# EAGLE design ESP32 Breakout (EAGLE 9.6.2)
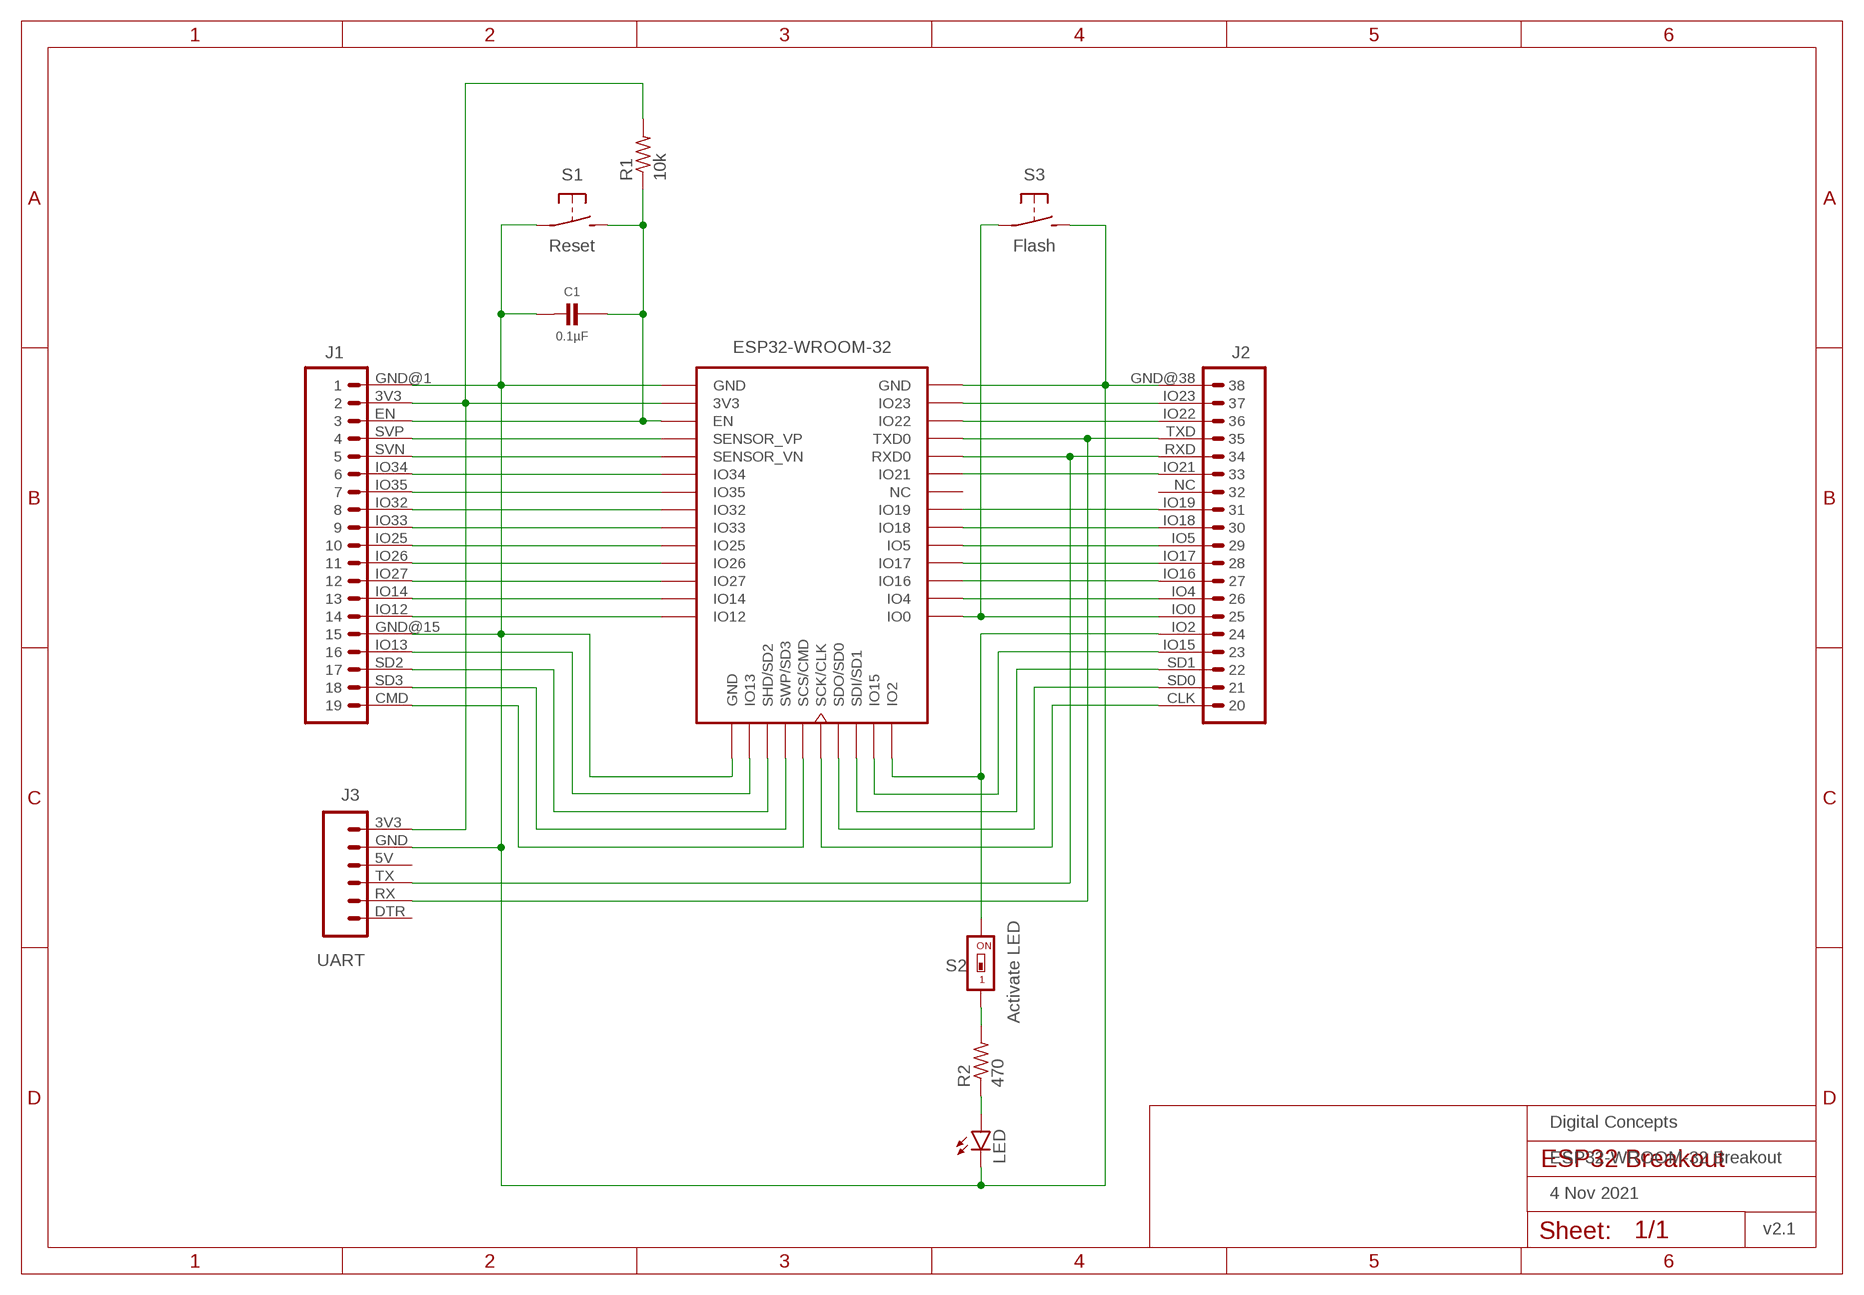
[diagram p0: schematic, sheet 1]
FRAME1 (A4L-LOC): DATE: 4 Nov 2021; OWNER: Digital Concepts; TITLE: ESP32-WROOM-32 Breakout; VERSION: v2.1

## Parts
C1  0.1µF  CAPACITOR-0805  [C0805]
J1  HEADER-1X19-ESP32-L  [CONN_19-ESP32-L]
J2  HEADER-1X19-ESP32-R  [CONN_19-ESP32-R]
J3  UART  HEADER-1X6-UART  [CONN_06-UART]
LED  LEDCHIP-LED0805  [CHIP-LED0805]
R1  10k  RESISTOR-VIA-2  [R0805-VIA-2]
R2  470  RESISTORR0805  [R0805]
S1  Reset  SWITCH-MOMENTARY-2-PIN  [SWITCH-2-PAD]
S2  Activate LED  SWITCH-DIP-SWS001  [SMD-001]
S3  Flash  SWITCH-MOMENTARY-2-PIN  [SWITCH-2-PAD]
U1  ESP32-WROOM-32  ESP32-WROOM-32-CHIP  [ESP32-WROOM-32]

## Nets
GND: C1.2 J1.GND@1 J1.GND@15 J2.GND@38 J3.GND LED.C S1.P$1(P) S3.P$2(S) U1.GND@1(GND) U1.GND@15(GND) U1.GND@38(GND) U1.TP(GND) U1.TP@P1(GND) U1.TP@P2(GND) U1.TP@P3(GND) U1.TP@P4(GND) U1.TP@P5(GND) U1.TP@P6(GND) U1.TP@P7(GND) U1.TP@P8(GND) U1.TP@P9(GND) U1.TP@V1(GND) U1.TP@V2(GND) U1.TP@V3(GND) U1.TP@V4(GND) U1.TP@V5(GND) U1.TP@V6(GND) U1.TP@V7(GND) U1.TP@V8(GND) U1.TP@V9(GND) U1.TP@V10(GND) U1.TP@V11(GND) U1.TP@V12(GND) U1.TP@VP5(GND)
N$1: R2.2 S2.1
N$2: J1.SVP U1.SENSOR_VP
N$3: C1.1 J1.EN R1.1 S1.P$2(S) U1.EN
N$4: J1.IO32 U1.IO32
N$5: J1.SVN U1.SENSOR_VN
N$6: J1.IO34 U1.IO34
N$7: J1.IO35 U1.IO35
N$8: LED.A R2.1
N$13: J2.IO19 U1.IO19
N$14: J2.IO17 U1.IO17
N$15: J1.CMD U1.CMD(SCS/CMD)
N$16: J2.IO18 U1.IO18
N$17: J2.IO22 U1.IO22
N$18: J2.IO15 U1.IO15
N$19: J2.CLK U1.CLK(SCK/CLK)
N$20: J2.SD0 U1.SD0(SDO/SD0)
N$21: J2.SD1 U1.SD1(SDI/SD1)
N$22: J2.IO23 U1.IO23
N$23: J2.IO2 S2.2 U1.IO2
N$24: J2.IO0 S3.P$1(P) U1.IO0
N$25: J2.IO4 U1.IO4
N$26: J2.IO16 U1.IO16
N$28: J2.IO5 U1.IO5
N$31: J2.RXD J3.TX U1.RXD0
N$32: J2.TXD J3.RX U1.TXD0
N$35: J2.IO21 U1.IO21
N$36: J1.IO33 U1.IO33
N$38: J1.IO25 U1.IO25
N$39: J1.IO26 U1.IO26
N$40: J1.IO27 U1.IO27
N$41: J1.IO14 U1.IO14
N$42: J1.IO12 U1.IO12
N$43: J1.SD2 U1.SD2(SHD/SD2)
N$45: J1.IO13 U1.IO13
N$46: J1.SD3 U1.SD3(SWP/SD3)
VCC: J1.3V3 J3.3V3 R1.2 R1.2@VIA U1.3V3
Unconnected: J2.NC J3.5V J3.DTR U1.NC

## Library data of the parts
C1 = digitalconcepts:CAPACITOR-0805: 0805 Capacitor
J1 = digitalconcepts:HEADER-1X19-ESP32-L: ESP32 Left 19-Pin Header
J2 = digitalconcepts:HEADER-1X19-ESP32-R: ESP32 Right 19-Pin Header
J3 = digitalconcepts:HEADER-1X6-UART: Single Row 6-Pin UART Header
LED = digitalconcepts:LED: LED OSRAM: - CHIPLED LG R971, LG N971, LY N971, LG Q971, LY Q971, LO R971, LY R971 LH N974, LH R974 LS Q976, LO Q976, LY Q976 LO Q996 - Hyper CHIPLED LW Q18S LB Q993, LB Q99A, LB R99A - SideLED LS A670, LO A670, LY A670, LG A670, LP A670 LB A673, LV A673, LT A673, LW A673 LH A674 LY A675 LS A676, LA A676, LO A676, LY A676, LW A676 LS A679, LY A679, LG A679 - Hyper Micro SIDELED® LS Y876, LA Y876, LO Y876, LY Y876 LT Y87S - SmartLED LW L88C, LW L88S LB L89C, LB L89S, LG L890 LS L89K, LO L89K, LY L89K LS L896, LA L896, LO L896, LY L896 - TOPLED LS T670, LO T670, LY T670, LG T670, LP T670 LSG T670, LSP T670, LSY T670, LOP T670, LYG T670 LG T671, LOG T671, LSG T671 LB T673, LV T673, LT T673, LW T673 LH T674 LS T676, LA T676, LO T676, LY T676, LB T676, LH T676, LSB T676, LW T676 LB T67C, LV T67C, LT T67C, LS T67K, LO T67K, LY T67K, LW E67C LS E67B, LA E67B, LO E67B, LY E67B, LB E67C, LV E67C, LT E67C LW T67C LS T679, LY T679, LG T679 LS T770, LO T770, LY T770, LG T770, LP T770 LB T773, LV T773, LT T773, LW T773 LH T774 LS E675, LA E675, LY E675, LS T675 LS T776, LA T776, LO T776, LY T776, LB T776 LHGB T686 LT T68C, LB T68C - Hyper Mini TOPLED® LB M676 - Mini TOPLED Santana® LG M470 LS M47K, LO M47K, LY M47K Source: http://www.osram.convergy.de LUXEON: - LUMILED® LXK2-PW12-R00, LXK2-PW12-S00, LXK2-PW14-U00, LXK2-PW14-V00 LXK2-PM12-R00, LXK2-PM12-S00, LXK2-PM14-U00 LXK2-PE12-Q00, LXK2-PE12-R00, LXK2-PE12-S00, LXK2-PE14-T00, LXK2-PE14-U00 LXK2-PB12-K00, LXK2-PB12-L00, LXK2-PB12-M00, LXK2-PB14-N00, LXK2-PB14-P00, LXK2-PB14-Q00 LXK2-PR12-L00, LXK2-PR12-M00, LXK2-PR14-Q00, LXK2-PR14-R00 LXK2-PD12-Q00, LXK2-PD12-R00, LXK2-PD12-S00 LXK2-PH12-R00, LXK2-PH12-S00 LXK2-PL12-P00, LXK2-PL12-Q00, LXK2-PL12-R00 Source: www.luxeon.com KINGBRIGHT: KA-3528ASYC Source: www.kingbright.com
R1 = digitalconcepts:RESISTOR-VIA-2: Resistor with via on Pad 2
R2 = digitalconcepts:RESISTOR: Resistor; SPICEPREFIX: R
S1 S3 = digitalconcepts:SWITCH-MOMENTARY-2-PIN: 2 Pin Momentary Switch
S2 = digitalconcepts:SWITCH-DIP-SWS001: SMD Dip Switch 1 pol.
U1 = digitalconcepts:ESP32-WROOM-32-CHIP: ESP32-WROOM-32 Chip

## Board
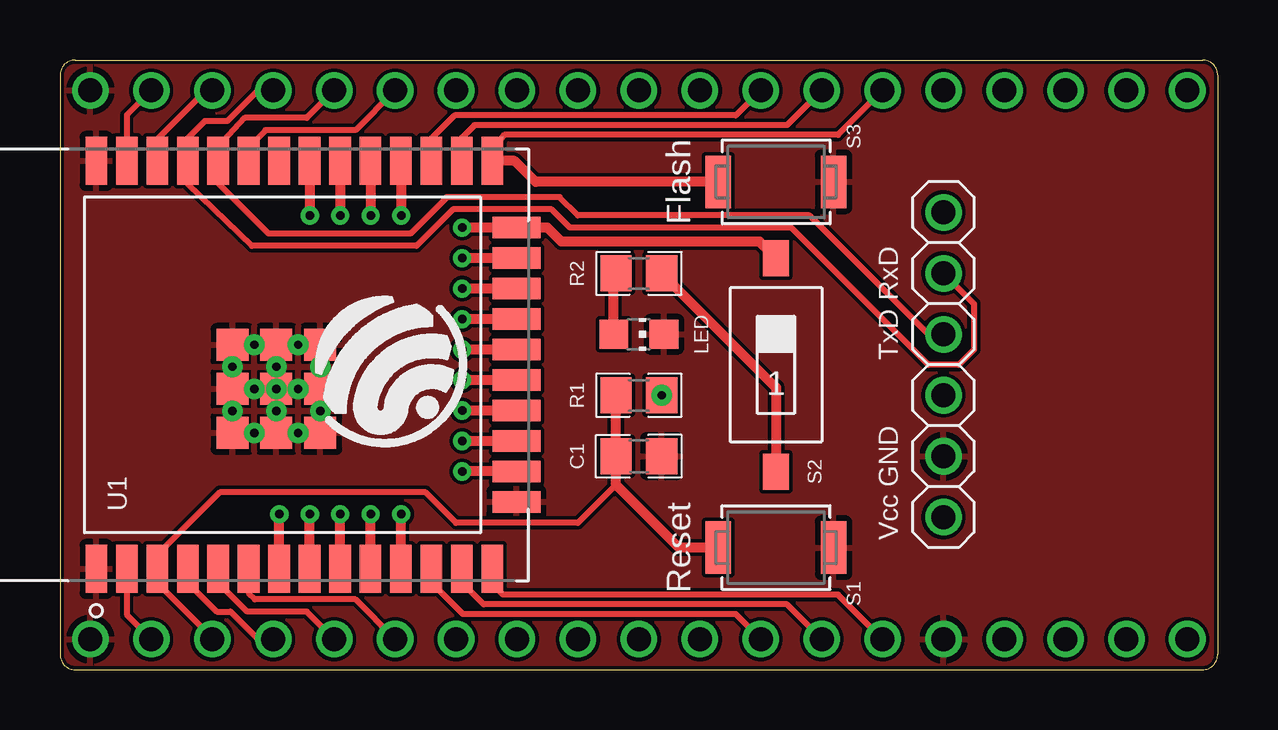
[diagram p1: board, top side]
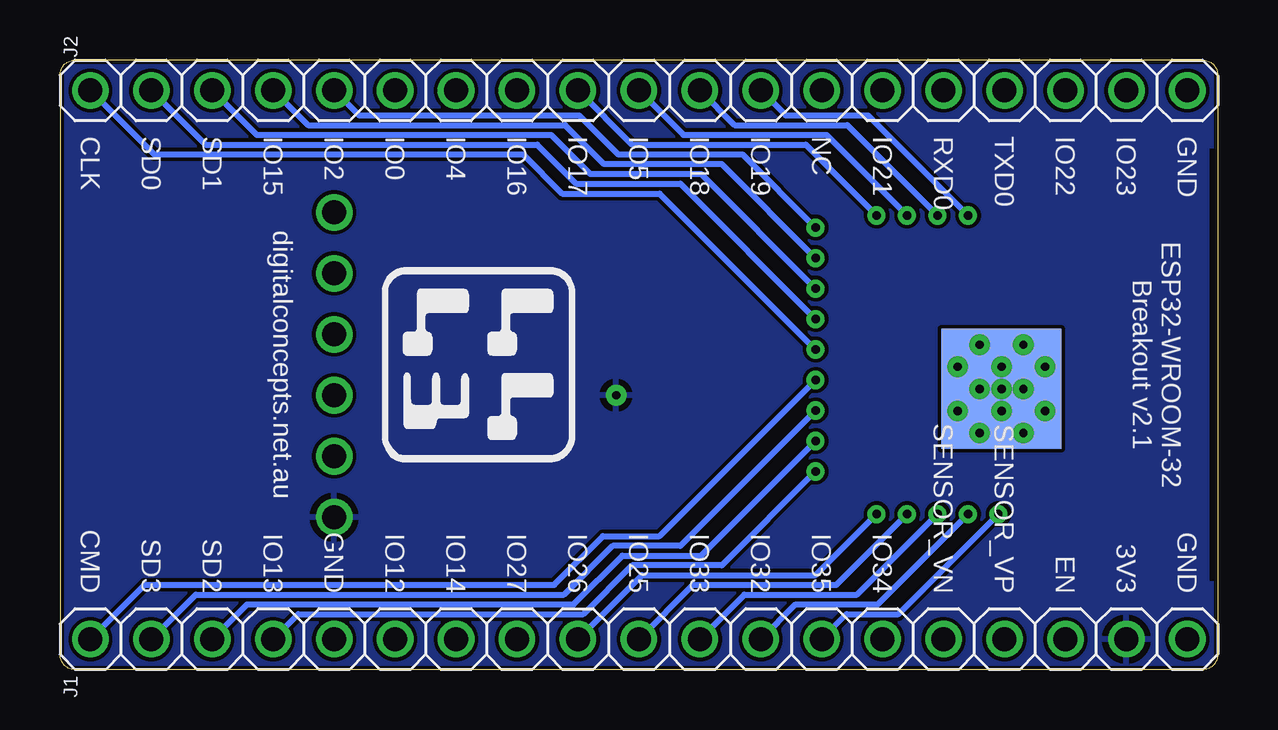
[diagram p2: board, bottom side, seen from below]

Size 48.26 x 25.4 mm. Coordinates in mm from the lower left corner, seen from the top.
Outline: 0,24.77 0,0.64 arc90 0.64,0 47.62,0 arc90 48.26,0.64 48.26,24.77 arc90 47.62,25.4 0.64,25.4 arc90 0,24.77
Copper layers (1*16): Top 0.035mm / dielectric 1.5mm / Bottom 0.035mm
Design rules "default *": minimum track width 6mil, minimum drill 0.35mm, track to track 6mil, track to pad 6mil, pad to pad 6mil, via to via 6mil, smd to smd 6mil, copper to edge 6mil, drill to drill 6mil, minimum pad ring 10mil, minimum via ring 8mil, stop-mask expansion 4mil, vias tented up to drill 0mil, thermal gap 10mil

### Footprints (pad centres in the part's own frame; a part is rotated, then mirrored left to right if it is on the bottom)
C0805 = smd 1.3 x 1.5: 1 -0.95,0; 2 0.95,0
CONN_19-ESP32-L = drill 1 pad 1.524: 3V3 43.18,0; CMD 0,0; EN 40.64,0; GND@1 45.72,0; GND@15 10.16,0; IO12 12.7,0; IO13 7.62,0; IO14 15.24,0; IO25 22.86,0; IO26 20.32,0; IO27 17.78,0; IO32 27.94,0; IO33 25.4,0; IO34 33.02,0; IO35 30.48,0; SD2 5.08,0; SD3 2.54,0; SVN 35.56,0; SVP 38.1,0
CONN_19-ESP32-R = drill 1 pad 1.524: CLK 0,0; GND@38 45.72,0; IO0 12.7,0; IO2 10.16,0; IO4 15.24,0; IO5 22.86,0; IO15 7.62,0; IO16 17.78,0; IO17 20.32,0; IO18 25.4,0; IO19 27.94,0; IO21 33.02,0; IO22 40.64,0; IO23 43.18,0; NC 30.48,0; RXD 35.56,0; SD0 2.54,0; SD1 5.08,0; TXD 38.1,0
CONN_06-UART = drill 1 pad 1.524: 3V3 12.7,0; 5V 7.62,0; DTR 0,0; GND 10.16,0; RX 2.54,0; TX 5.08,0
CHIP-LED0805 = smd 1.2 x 1.2: A 0,-1.05; C 0,1.05
R0805-VIA-2 = smd 1.3 x 1.5: 1 -0.95,0; 2 0.95,0 | drill 0.35 pad 0.61: 2@VIA 0.95,0
R0805 = smd 1.3 x 1.5: 1 -0.95,0; 2 0.95,0
SWITCH-2-PAD = smd 1.067 x 2.184: P$1 -2.4,0; P$2 2.4,0
SMD-001 = smd 1.1 x 1.5: 1 0,-4.45; 2 0,4.45
ESP32-WROOM-32 = smd 2 x 0.9: 3V3 -8.5,6.74; EN -8.5,5.47; GND@1 -8.5,8.01; GND@38 8.5,8.01; IO0 8.5,-8.5; IO4 8.5,-7.23; IO5 8.5,-3.42; IO12 -8.5,-8.5; IO14 -8.5,-7.23; IO16 8.5,-5.96; IO17 8.5,-4.69; IO18 8.5,-2.15; IO19 8.5,-0.88; IO21 8.5,1.66; IO22 8.5,5.47; IO23 8.5,6.74; IO25 -8.5,-3.42; IO26 -8.5,-4.69; IO27 -8.5,-5.96; IO32 -8.5,-0.88; IO33 -8.5,-2.15; IO34 -8.5,1.66; IO35 -8.5,0.39; NC 8.5,0.39; RXD0 8.5,2.93; SENSOR_VN -8.5,2.93; SENSOR_VP -8.5,4.2; TXD0 8.5,4.2 | smd 0.9 x 2: CLK 0.635,-9.5; CMD -0.635,-9.5; GND@15 -5.715,-9.5; IO2 5.715,-9.5; IO13 -4.445,-9.5; IO15 4.445,-9.5; SD0 1.905,-9.5; SD1 3.175,-9.5; SD2 -3.175,-9.5; SD3 -1.905,-9.5 | smd 5 x 5 bottom: TP -1,0.51 | smd 1.33 x 1.33: TP@P1 -2.835,2.335; TP@P2 -1,2.335; TP@P3 0.835,2.335; TP@P4 -2.835,0.51; TP@P5 -1,0.51; TP@P6 0.835,0.51; TP@P7 -2.835,-1.325; TP@P8 -1,-1.325; TP@P9 0.835,-1.325 | drill 0.35 pad 0.406: TP@V1 -1.917,2.335; TP@V2 -0.083,2.335; TP@V3 -2.835,1.423; TP@V4 -1,1.423; TP@V5 0.835,1.423; TP@V6 -1.917,0.51; TP@V7 -0.083,0.51; TP@V8 -2.835,-0.403; TP@V9 -1,-0.403; TP@V10 0.835,-0.403; TP@V11 -1.917,-1.325; TP@V12 -0.083,-1.325; TP@VP5 -1,0.51

### Placement (x,y rotation side)
C1  24.13,8.89 0 top
J1  46.99,1.27 0 bottom
J2  46.99,24.13 0 bottom
J3  36.83,19.05 270 top
LED  24.13,13.97 270 top
R1  24.13,11.43 0 top
R2  24.13,16.51 0 top
S1  29.85,5.08 180 top
S2  29.85,12.7 0 top
S3  29.85,20.32 0 top
U1  9.53,12.7 90 top

### Tracks (layer width: path | path; a pad name or v marks a point on that pad's centre or on a via)
GND
  pour Top (rank 3): -1.27,26.67 49.53,26.67 49.53,-1.4 -1.27,-1.4
N$1
  Top 0.406: R2.2 29.85,11.75 S2.1
N$2
  Top 0.254: U1.SENSOR_VP 5.32,3.62 6.54,2.41 7.11,2.41 8.25,1.27 J1.SVP
N$3
  Top 0.254: J1.EN 6.35,1.33 4.05,3.62 U1.EN 4.05,4.78 6.66,7.38 15.24,7.38 16.51,6.11 21.59,6.11 23.18,7.7
  Top 0.406: R1.1 C1.1 23.18,7.7 25.8,5.08 S1.P$2
N$4  (via drill 0.35)
  Top 0.406: U1.IO32 10.41,6.47 v10.41,6.48
  Bottom 0.254: v10.41,6.48 14.17,2.72 17.6,2.72 J1.IO32
N$5
  Top 0.254: U1.SENSOR_VN 6.6,3.62 7.81,2.41 10.29,2.41 J1.SVN
N$6
  Top 0.254: U1.IO34 7.87,3.18 8.13,2.92 12.32,2.92 J1.IO34
N$7  (via drill 0.35)
  Top 0.406: U1.IO35 9.14,6.47 v9.14,6.48
  Bottom 0.254: v9.14,6.48 13.31,2.31 15.47,2.31 J1.IO35
N$8
  Top 0.406: LED.A 23.08,16.41 R2.1
N$13  (via drill 0.35)
  Top 0.406: U1.IO19 v10.41,18.92
  Bottom 0.254: v10.41,18.92 14.58,23.09 18.01,23.09 J2.IO19
N$14  (via drill 0.35)
  Top 0.406: U1.IO17 14.21,18.93 v14.22,18.92
  Bottom 0.254: v14.22,18.92 17.17,21.87 24.41,21.87 J2.IO17
N$15  (via drill 0.35)
  Top 0.406: U1.CMD v16.76,12.07
  Bottom 0.254: J1.CMD 44.73,3.53 27.66,3.53 25.63,5.56 23.27,5.56 v16.76,12.07
N$16  (via drill 0.35)
  Top 0.406: U1.IO18 11.68,18.93 v11.68,18.92
  Bottom 0.254: v11.68,18.92 15.44,22.68 20.14,22.68 J2.IO18
N$17
  Top 0.254: U1.IO22 4.05,22.09 6.1,24.13 J2.IO22
N$18  (via drill 0.35)
  Top 0.406: U1.IO15 v16.76,17.14
  Bottom 0.254: v16.76,17.14 20.68,21.06 25.58,21.06 27.2,22.68 37.92,22.68 J2.IO15
N$19  (via drill 0.35)
  Top 0.406: U1.CLK v16.76,13.34
  Bottom 0.254: v16.76,13.34 23.27,19.84 27.33,19.84 28.96,21.46 44.32,21.46 J2.CLK
N$20  (via drill 0.35)
  Top 0.406: U1.SD0 v16.76,14.61
  Bottom 0.254: v16.76,14.61 22.4,20.24 26.75,20.24 28.37,21.87 42.19,21.87 J2.SD0
N$21  (via drill 0.35)
  Top 0.406: U1.SD1 v16.76,15.88
  Bottom 0.254: v16.76,15.88 21.54,20.65 26.16,20.65 27.79,22.28 40.06,22.28 J2.SD1
N$22
  Top 0.254: J2.IO23 2.79,23.11 U1.IO23
N$23  (via drill 0.35)
  Top 0.406: v16.76,18.41 U1.IO2 20.32,18.41 20.9,17.83 29.16,17.83 S2.2
  Bottom 0.254: v16.76,18.41 19.81,21.46 24.99,21.46 26.62,23.09 35.79,23.09 J2.IO2
N$24
  Top 0.254: U1.IO0 18.03,21.64 18.51,22.28 32.44,22.28 J2.IO0
  Top 0.406: S3.P$1 19.82,20.32 18.95,21.2 U1.IO0
N$25
  Top 0.254: U1.IO4 16.75,22.17 17.27,22.68 30.3,22.68 J2.IO4
N$26
  Top 0.254: U1.IO16 15.48,22.13 16.44,23.09 28.17,23.09 J2.IO16
N$28  (via drill 0.35)
  Top 0.406: U1.IO5 v12.95,18.92
  Bottom 0.254: v12.95,18.92 16.31,22.28 22.28,22.28 J2.IO5
N$31
  Top 0.254: J2.RXD 10.29,22.99 7.71,22.99 6.6,21.78 U1.RXD0 6.6,20.25 8.69,18.16 14.61,18.16 16.13,19.68 20.83,19.68 21.59,18.92 31.24,18.92 36.2,13.97 J3.TX
N$32
  Top 0.254: J2.TXD 8.25,24.13 6.98,22.85 6.04,22.85 5.32,22.14 U1.TXD0 5.32,20.24 8.01,17.65 14.86,17.65 16.38,19.18 20.5,19.18 21.26,18.41 30.48,18.41 36.2,12.7 37.47,12.7 38.1,13.34 38.1,15.24 J3.RX
N$35
  Top 0.254: U1.IO21 7.87,21.78 8.57,22.48 12.32,22.48 J2.IO21
N$36  (via drill 0.35)
  Top 0.406: U1.IO33 11.68,6.47 v11.68,6.48
  Bottom 0.254: v11.68,6.48 15.04,3.12 19.74,3.12 J1.IO33
N$38  (via drill 0.35)
  Top 0.406: U1.IO25 12.95,6.47 v12.95,6.48
  Bottom 0.254: v12.95,6.48 15.9,3.53 21.87,3.53 J1.IO25
N$39  (via drill 0.35)
  Top 0.406: U1.IO26 14.21,6.47 v14.22,6.48
  Bottom 0.254: v14.22,6.48 16.76,3.94 24,3.94 J1.IO26
N$40
  Top 0.254: U1.IO27 15.48,3.62 16.8,2.31 28.17,2.31 J1.IO27
N$41
  Top 0.254: U1.IO14 16.75,3.62 17.66,2.72 30.3,2.72 J1.IO14
N$42
  Top 0.254: U1.IO12 18.03,3.57 18.47,3.12 32.44,3.12 J1.IO12
N$43  (via drill 0.35)
  Top 0.406: U1.SD2 v16.76,9.53
  Bottom 0.254: v16.76,9.53 21.54,4.75 24.82,4.75 26.85,2.72 40.46,2.72 J1.SD2
N$45  (via drill 0.35)
  Top 0.406: U1.IO13 v16.76,8.25
  Bottom 0.254: v16.76,8.25 20.68,4.34 24.41,4.34 26.44,2.31 38.33,2.31 J1.IO13
N$46  (via drill 0.35)
  Top 0.406: U1.SD3 v16.76,10.8
  Bottom 0.254: v16.76,10.8 22.4,5.16 25.22,5.16 27.25,3.12 42.6,3.12 J1.SD3
VCC
  Top 0.254: U1.3V3 2.79,2.29 J1.3V3
  pour Bottom (rank 3): -0.63,26.04 48.89,26.04 48.89,-0.63 -0.63,-0.63

### Text on the board
tPlace: RxD | TxD | GND | Vcc
bPlace: GND | IO23 | IO22 | TXD0 | RXD0 | IO21 | NC | IO19 | IO18 | IO5 | IO17 | IO16 | IO4 | IO0 | IO2 | IO15 | SD1 | SD0 | CLK | ESP32-WROOM-32 / Breakout v2.1 | digitalconcepts.net.au | GND | 3V3 | EN | SENSOR_VP | SENSOR_VN | IO34 | IO35 | IO32 | IO33 | IO25 | IO26 | IO27 | IO14 | IO12 | GND | IO13 | SD2 | SD3 | CMD